# EAGLE schematic clk (EAGLE 7.6.0)
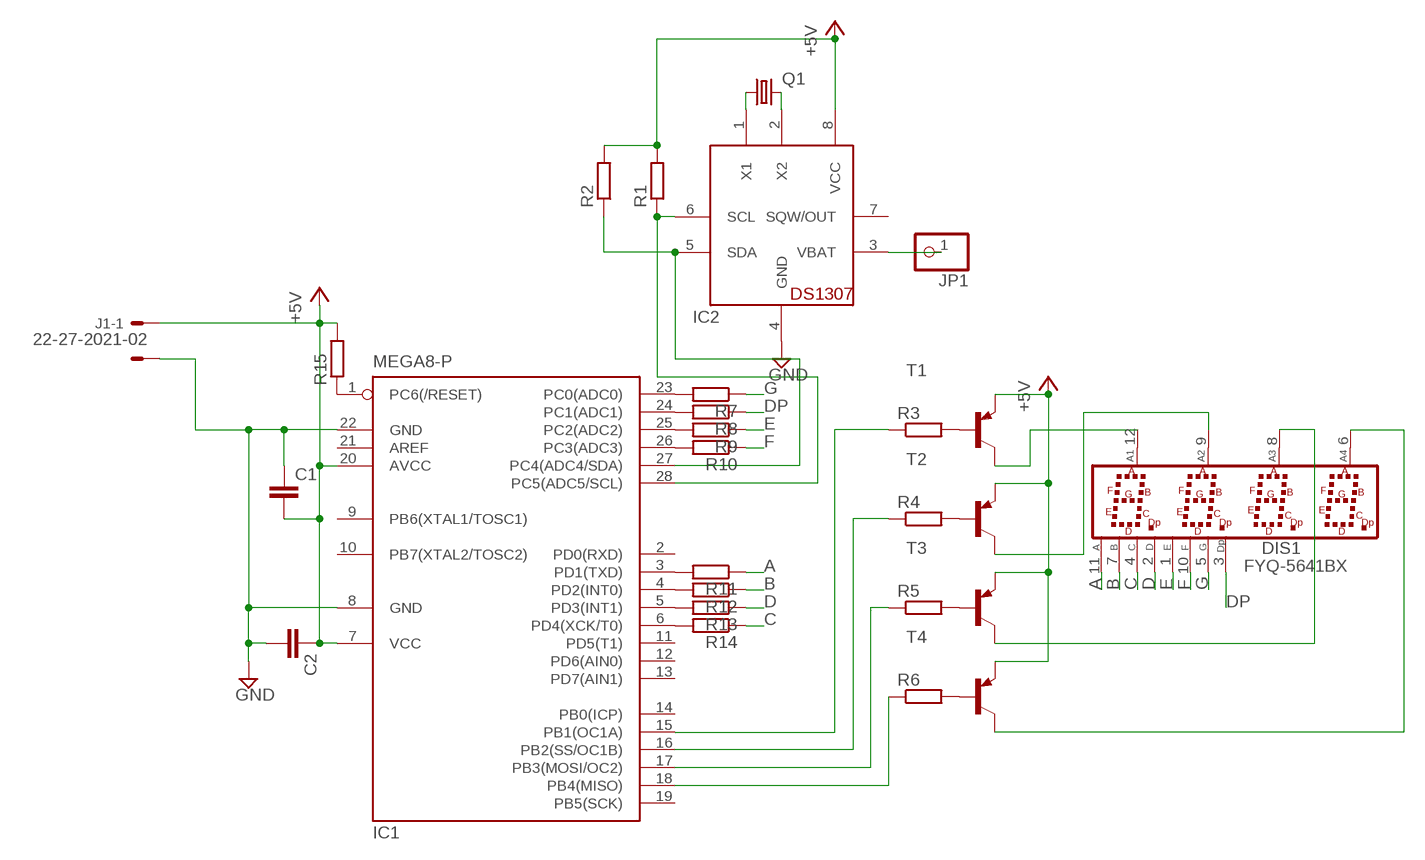
[diagram p0: schematic, sheet 1]

## Parts
C1  C-EU025-024X044  [C025-024X044]
C2  C-EU025-024X044  [C025-024X044]
DIS1  FYQ-5641BX  [FYQ5641]
IC1  MEGA8-P  [DIL28-3]
IC2  DS1307  [DIL08]
J1  22-27-2021-02  [6410-02]
JP1  PINHD-1X1  [1X01]
Q1  CRYSTALTC26V  [TC26V]
R1  R-EU_0207/2V  [0207/2V]
R2  R-EU_0207/2V  [0207/2V]
R3  R-EU_0204/2V  [0204V]
R4  R-EU_0204/2V  [0204V]
R5  R-EU_0204/2V  [0204V]
R6  R-EU_0204/2V  [0204V]
R7  R-EU_0207/2V  [0207/2V]
R8  R-EU_0207/2V  [0207/2V]
R9  R-EU_0207/2V  [0207/2V]
R10  R-EU_0207/2V  [0207/2V]
R11  R-EU_0207/2V  [0207/2V]
R12  R-EU_0207/2V  [0207/2V]
R13  R-EU_0207/2V  [0207/2V]
R14  R-EU_0207/2V  [0207/2V]
R15  R-EU_0204/2V  [0204V]
T1  BC327-PNP-TO92-EBC  [TO92-EBC]
T2  BC327-PNP-TO92-EBC  [TO92-EBC]
T3  BC327-PNP-TO92-EBC  [TO92-EBC]
T4  BC327-PNP-TO92-EBC  [TO92-EBC]

## Nets
+5V: C1.2 C2.1 IC1.7(VCC) IC1.20(AVCC) IC2.8(VCC) J1.1 R1.2 R2.2 R15.2 T1.E T2.E T3.E T4.E
A: DIS1.11(A) R11.1
B: DIS1.7(B) R12.1
C: DIS1.4(C) R14.1
D: DIS1.2(D) R13.1
D2: DIS1.9(A2) T2.C
D3: DIS1.8(A3) T3.C
DOT: IC1.27(PC4(ADC4/SDA)) IC2.5(SDA) R2.1
DP: DIS1.3(DP) R8.1
E: DIS1.1(E) R9.1
F: DIS1.10(F) R10.1
G: DIS1.5(G) R7.1
GND: C1.1 C2.2 IC1.8(GND) IC1.22(GND) IC2.4(GND) J1.2
N$1: IC2.1(X1) Q1.1
N$2: IC2.2(X2) Q1.2
N$3: IC1.23(PC0(ADC0)) R7.2
N$4: IC1.24(PC1(ADC1)) R8.2
N$5: DIS1.6(A4) T4.C
N$6: IC1.28(PC5(ADC5/SCL)) IC2.6(SCL) R1.1
N$7: IC2.3(VBAT) JP1.1
N$8: IC1.25(PC2(ADC2)) R9.2
N$9: R5.2 T3.B
N$10: R3.2 T1.B
N$11: R4.2 T2.B
N$12: R6.2 T4.B
N$13: IC1.1(PC6(/RESET)) R15.1
N$14: IC1.16(PB2(SS/OC1B)) R4.1
N$15: IC1.17(PB3(MOSI/OC2)) R5.1
N$16: IC1.18(PB4(MISO)) R6.1
N$17: IC1.26(PC3(ADC3)) R10.2
N$18: IC1.3(PD1(TXD)) R11.2
N$19: IC1.4(PD2(INT0)) R12.2
N$20: IC1.5(PD3(INT1)) R13.2
N$21: IC1.6(PD4(XCK/T0)) R14.2
N$22: IC1.15(PB1(OC1A)) R3.1
N$23: DIS1.12(A1) T1.C
Unconnected: IC1.2(PD0(RXD)) IC1.9(PB6(XTAL1/TOSC1)) IC1.10(PB7(XTAL2/TOSC2)) IC1.11(PD5(T1)) IC1.12(PD6(AIN0)) IC1.13(PD7(AIN1)) IC1.14(PB0(ICP)) IC1.19(PB5(SCK)) IC1.21(AREF) IC2.7(SQW/OUT)

## Library data of the parts
C1 C2 = rcl:C-EU: CAPACITOR, European symbol
DIS1 = LED 7seg:FYQ-5641BX
IC1 = atmel:MEGA8-P: MICROCONTROLLER 8 Kbytes FLASH, 1 kbytes SRAM, 512 bytes EEPROM, USART, 4-channel 10 bit ADC, 2-channel 8 bit ADC Pin compatible with Atmega48, ATMega88, ATMega168 Source: avr.lbr; OC_FARNELL: unknown; OC_NEWARK: unknown
IC2 = adafruit:DS1307: DS1307 Real time clock (RTC) with battery backup ability. Talk to it via i2c
J1 = con-molex:22-?-02: CONNECTOR wire to board 2.54 mm (.1 inch) pitch header; OC_FARNELL: unknown; OC_NEWARK: unknown
JP1 = adafruit:PINHD-1X1: Pin header 1x1 for 0.1" spacing With round pins
Q1 = adafruit:CRYSTAL: CRYSTAL; OC_FARNELL: unknown; OC_NEWARK: unknown
R1-R15 = rcl:R-EU_: RESISTOR, European symbol
T1-T4 = transistor:*-PNP-: PNP Transistror